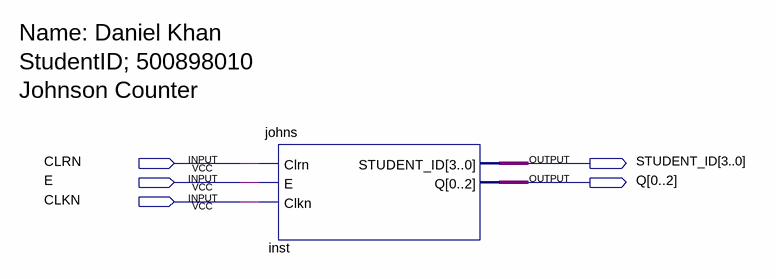
[diagram p0: schematic sheet]
// Quartus schematic Johnsschem.bdf as structural Verilog: 1 symbols, 5 pins
module Johnsschem (
  input  CLRN,
  input  E,
  input  CLKN,
  output [3:0] STUDENT_ID,
  output [0:2] Q
);

  johns inst (.Clrn(CLRN), .E(E), .Clkn(CLKN), .STUDENT_ID(STUDENT_ID), .Q(Q));

  // Notes on the sheet:
  //   Name: Daniel Khan
  //   StudentID; 500898010
  //   Johnson Counter
endmodule
